# EAGLE schematic CryptoFlashRTC (EAGLE 7.7.0)

## Sheet 1 of 3
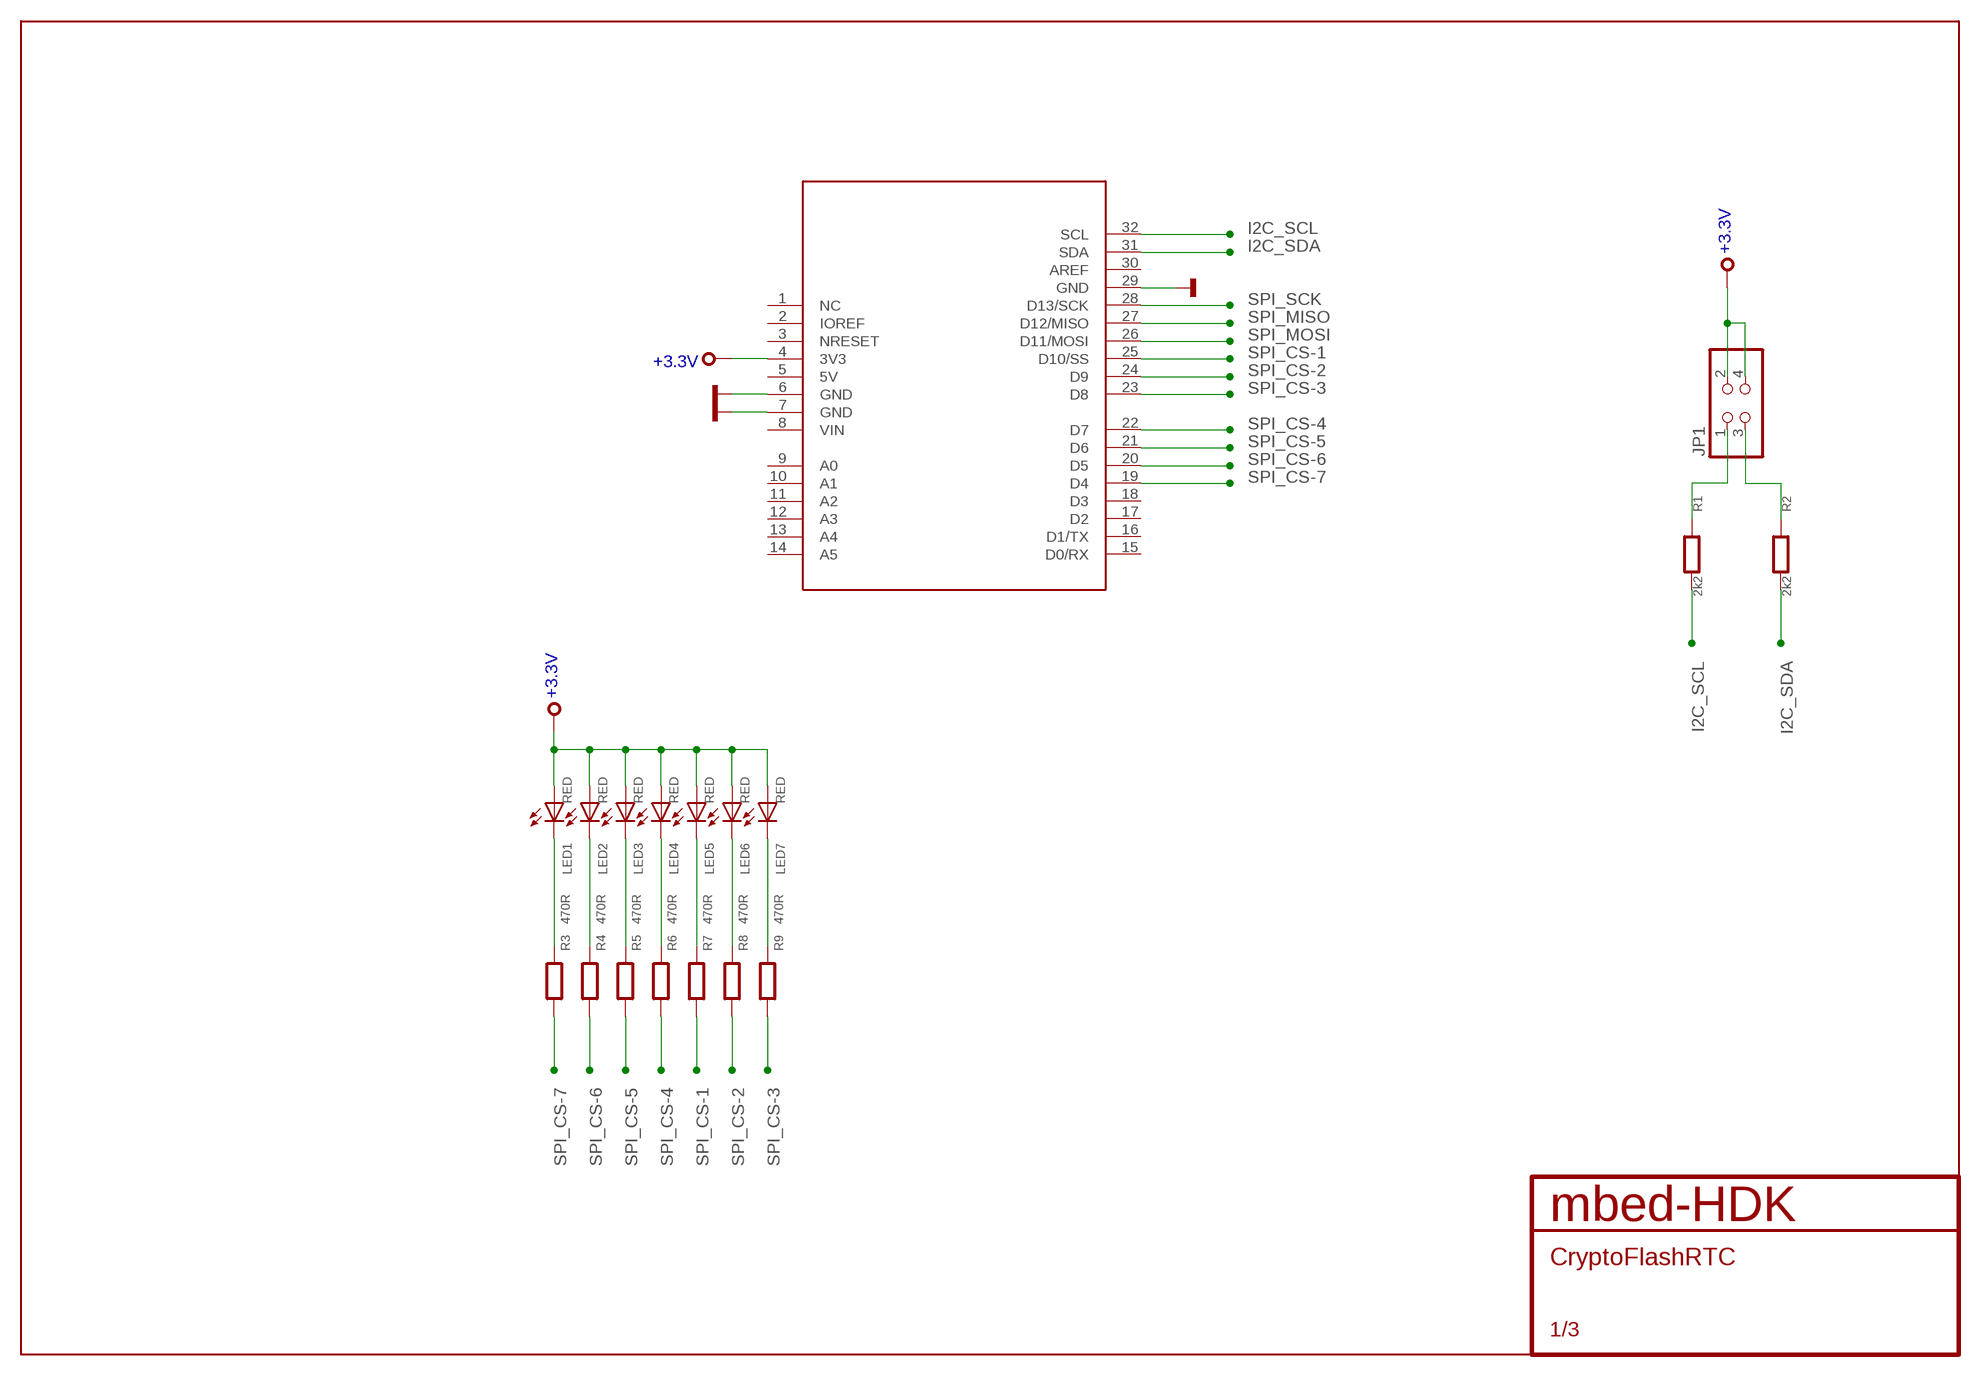
[diagram p0: schematic, sheet 1]

### Parts
BRD1  K64F/K22F-SHIELD  [K64F/K22F]
JP1  PINHD-2X2  [2X02]
LED1  RED  SMD_LED0603  [CHIPLED_0603]
LED2  RED  SMD_LED0603  [CHIPLED_0603]
LED3  RED  SMD_LED0603  [CHIPLED_0603]
LED4  RED  SMD_LED0603  [CHIPLED_0603]
LED5  RED  SMD_LED0603  [CHIPLED_0603]
LED6  RED  SMD_LED0603  [CHIPLED_0603]
LED7  RED  SMD_LED0603  [CHIPLED_0603]
R1  2k2  R0603  [0603]
R2  2k2  R0603  [0603]
R3  470R  R0603  [0603]
R4  470R  R0603  [0603]
R5  470R  R0603  [0603]
R6  470R  R0603  [0603]
R7  470R  R0603  [0603]
R8  470R  RESISTOR0603  [0603]
R9  470R  R0603  [0603]

### Nets
+3.3V: BRD1.4(3V3) JP1.2 JP1.4 LED1.A LED2.A LED3.A LED4.A LED5.A LED6.A LED7.A ; also sheet 2,3
GND: BRD1.6(GND) BRD1.7(GND) BRD1.29(GND) ; also sheet 2,3
I2C_SCL: BRD1.32(SCL) R1.2 ; also sheet 2,3
I2C_SDA: BRD1.31(SDA) R2.2 ; also sheet 2,3
N$1: LED1.C R3.1
N$2: LED2.C R4.1
N$3: LED3.C R5.1
N$4: LED4.C R6.1
N$5: LED5.C R7.1
N$6: LED6.C R8.1
N$7: LED7.C R9.1
N$8: JP1.1 R1.1
N$9: JP1.3 R2.1
SPI_CS-1: BRD1.25(D10/SS) R7.2 ; also sheet 2
SPI_CS-2: BRD1.24(D9) R8.2 ; also sheet 2
SPI_CS-3: BRD1.23(D8) R9.2 ; also sheet 2
SPI_CS-4: BRD1.22(D7) R6.2 ; also sheet 2
SPI_CS-5: BRD1.21(D6) R5.2 ; also sheet 2
SPI_CS-6: BRD1.20(D5) R4.2 ; also sheet 2
SPI_CS-7: BRD1.19(D4) R3.2 ; also sheet 2
SPI_MISO: BRD1.27(D12/MISO) ; also sheet 2
SPI_MOSI: BRD1.26(D11/MOSI) ; also sheet 2
SPI_SCK: BRD1.28(D13/SCK) ; also sheet 2
Unconnected: BRD1.1(NC) BRD1.2(IOREF) BRD1.3(NRESET) BRD1.5(5V) BRD1.8(VIN) BRD1.9(A0) BRD1.10(A1) BRD1.11(A2) BRD1.12(A3) BRD1.13(A4) BRD1.14(A5) BRD1.15(D0/RX) BRD1.16(D1/TX) BRD1.17(D2) BRD1.18(D3) BRD1.30(AREF)

## Sheet 2 of 3
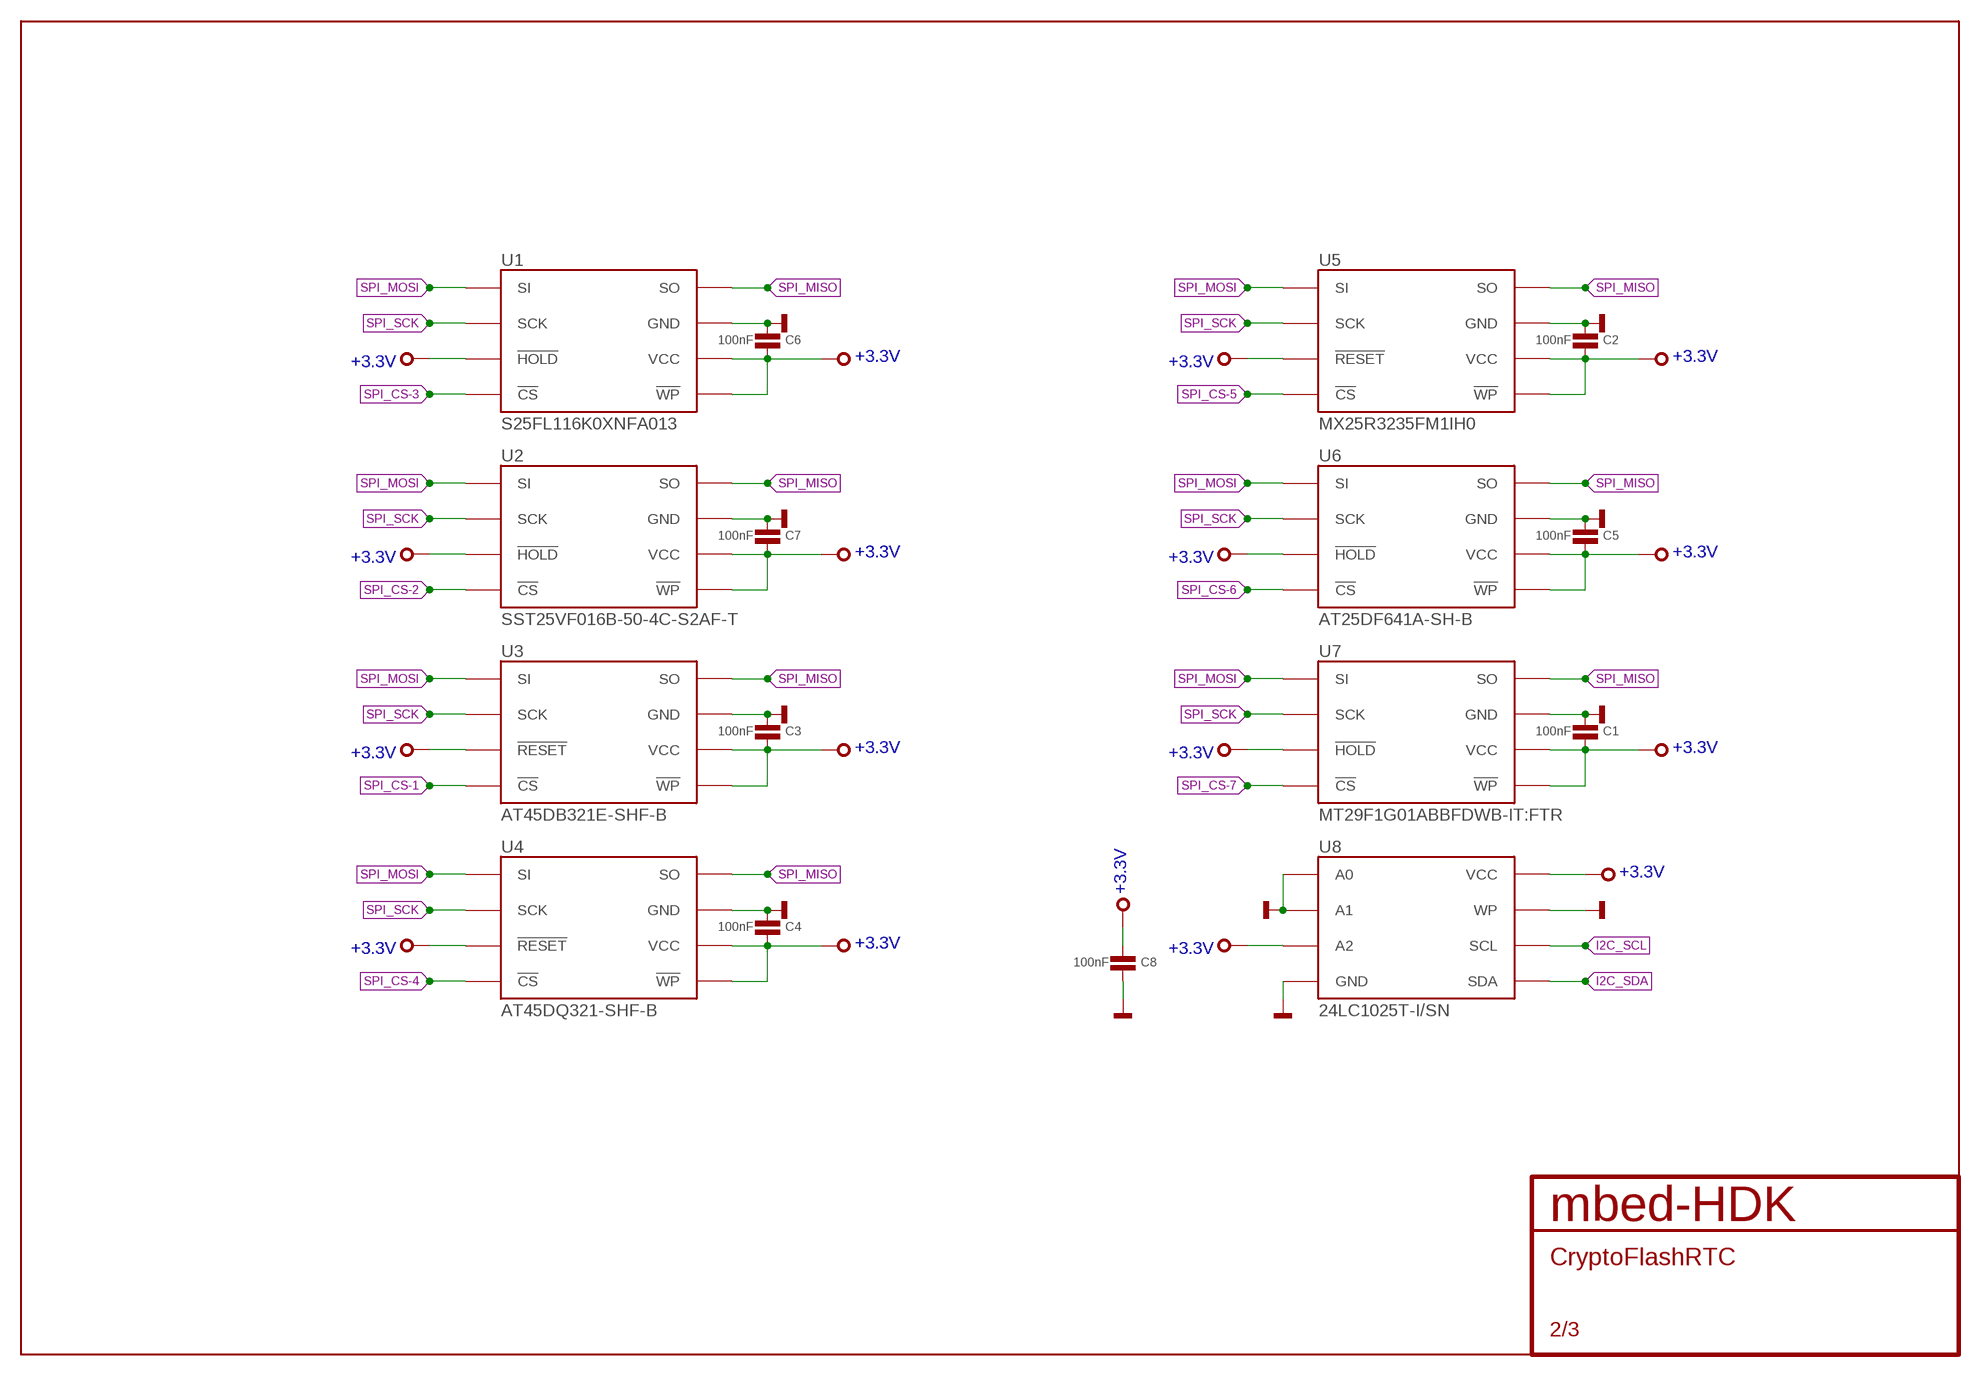
[diagram p1: schematic, sheet 2]

### Parts
C1  100nF  C0603  [0603]
C2  100nF  C0603  [0603]
C3  100nF  C0603  [0603]
C4  100nF  C0603  [0603]
C5  100nF  C0603  [0603]
C6  100nF  C0603  [0603]
C7  100nF  C0603  [0603]
C8  100nF  C0603  [0603]
U1  S25FL116K0XNFA013  [SO8-WIDE@1]
U2  SST25VF016B-50-4C-S2AF-T  [SO8-WIDE]
U3  AT45DB321E-SHF-B  [SO8-WIDE]
U4  AT45DQ321-SHF-B  [SO8-WIDE]
U5  MX25R3235FM1IH0  [SO8]
U6  AT25DF641A-SH-B  [SO8-WIDE]
U7  MT29F1G01ABBFDWB-IT:FTR  [8-U-PDFN]
U8  24LC1025T-I/SN  [SO8]

### Nets
+3.3V: C1.1 C2.1 C3.1 C4.1 C5.1 C6.1 C7.1 C8.2 U1.3(!WP) U1.7(!HOLD) U1.8(VCC) U2.3(!WP) U2.7(!HOLD) U2.8(VCC) U3.3(!RESET) U3.5(!WP) U3.6(VCC) U4.3(!RESET) U4.5(!WP) U4.6(VCC) U5.3(!WP) U5.7(!RESET) U5.8(VCC) U6.3(!WP) U6.7(!HOLD) U6.8(VCC) U7.3(!WP) U7.7(!HOLD) U7.8(VCC) U8.3(A2) U8.8(VCC) ; also sheet 1,3
GND: C1.2 C2.2 C3.2 C4.2 C5.2 C6.2 C7.2 C8.1 U1.4(GND) U2.4(GND) U3.7(GND) U4.7(GND) U5.4(GND) U6.4(GND) U7.4(GND) U8.1(A0) U8.2(A1) U8.4(GND) U8.7(WP) ; also sheet 1,3
I2C_SCL: U8.6(SCL) ; also sheet 1,3
I2C_SDA: U8.5(SDA) ; also sheet 1,3
SPI_CS-1: U3.4(!CS) ; also sheet 1
SPI_CS-2: U2.1(!CS) ; also sheet 1
SPI_CS-3: U1.1(!CS) ; also sheet 1
SPI_CS-4: U4.4(!CS) ; also sheet 1
SPI_CS-5: U5.1(!CS) ; also sheet 1
SPI_CS-6: U6.1(!CS) ; also sheet 1
SPI_CS-7: U7.1(!CS) ; also sheet 1
SPI_MISO: U1.2(SO) U2.2(SO) U3.8(SO) U4.8(SO) U5.2(SO) U6.2(SO) U7.2(SO) ; also sheet 1
SPI_MOSI: U1.5(SI) U2.5(SI) U3.1(SI) U4.1(SI) U5.5(SI) U6.5(SI) U7.5(SI) ; also sheet 1
SPI_SCK: U1.6(SCK) U2.6(SCK) U3.2(SCK) U4.2(SCK) U5.6(SCK) U6.6(SCK) U7.6(SCK) ; also sheet 1

## Sheet 3 of 3
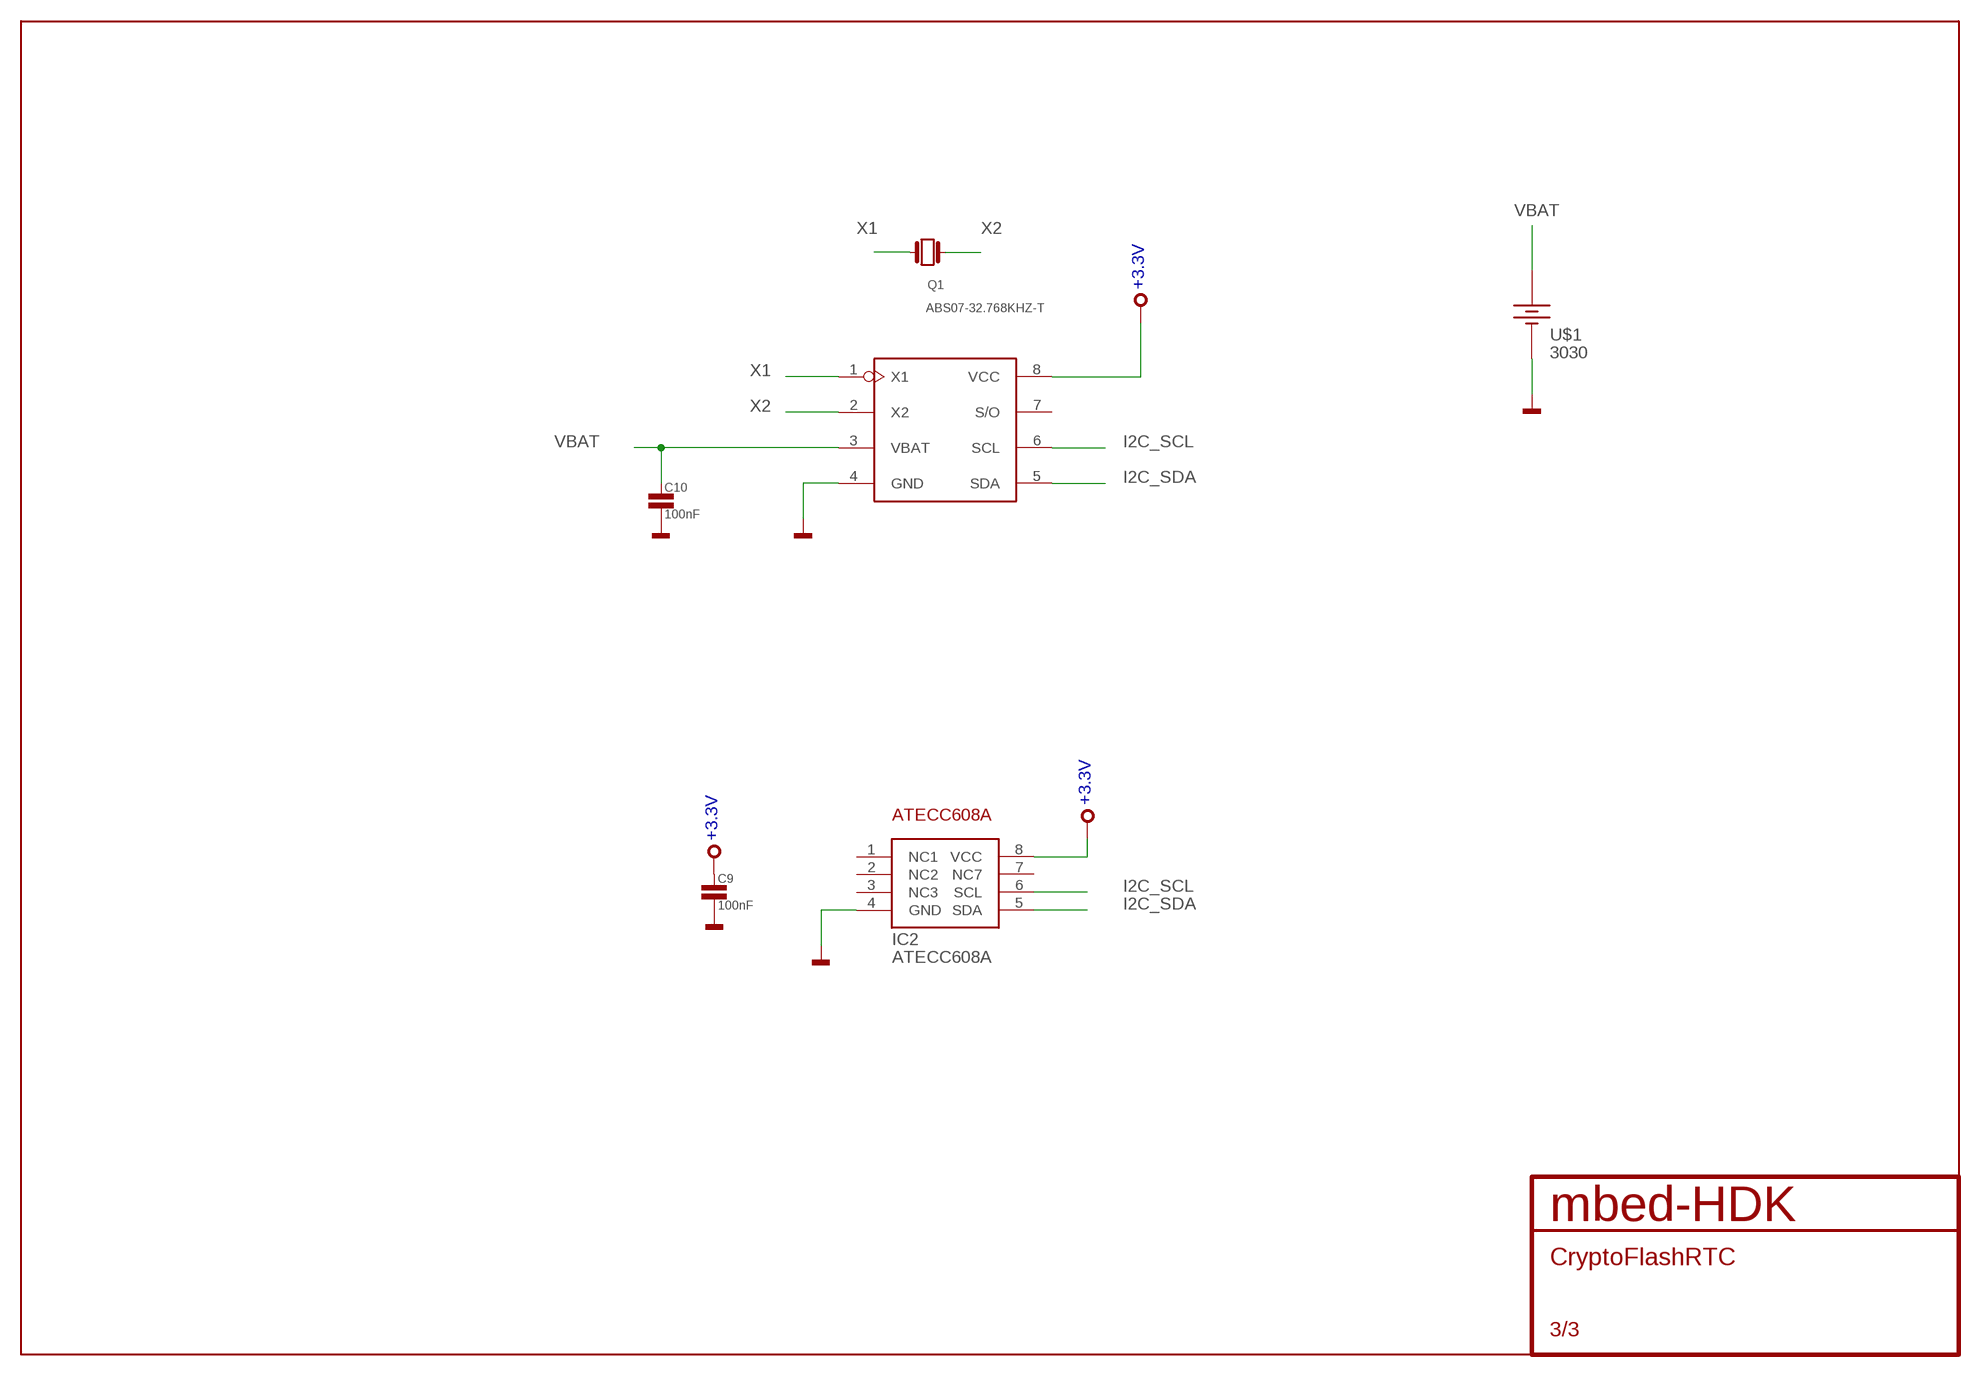
[diagram p2: schematic, sheet 3]

### Parts
C9  100nF  C0603  [0603]
C10  100nF  C0603  [0603]
IC2  ATECC608A  [SO8]
Q1  ABS07-32.768KHZ-T  [FC135]
U9  DS1307  [SO08]
U$1  3030  [3030]

### Nets
+3.3V: C9.1 IC2.8(VCC) U9.8(VCC) ; also sheet 1,2
GND: C9.2 C10.2 IC2.4(GND) U9.4(GND) U$1.NEG(-) ; also sheet 1,2
I2C_SCL: IC2.6(SCL) U9.6(SCL) ; also sheet 1,2
I2C_SDA: IC2.5(SDA) U9.5(SDA) ; also sheet 1,2
VBAT: C10.1 U9.3(VBAT) U$1.P$1(+) U$1.P$2(+)
X1: Q1.X1 U9.1(X1)
X2: Q1.X2 U9.2(X2)
Unconnected: IC2.1(NC1) IC2.2(NC2) IC2.3(NC3) IC2.7(NC7) U9.7(S/O)

## Library data of the parts
BRD1 = mbed-HDK-misc-Board:K64F/K22F-SHIELD: Shield for K64F/K22F
C1-C10 = mbed-HDK-RLC:C: Capacitor
IC2 = mbed-HDK-MF-ATMEL:ATECC608A
JP1 = pinhead:PINHD-2X2: PIN HEADER
LED1-LED7 = mbed-HDK-Optical:SMD_LED: LED SMD, Colour Red; MF: Wurth Electronics Inc; MFN: 150060RS75000; OC-DIGIKEY: 732-4978-1-ND; OC-MOUSER: 710-150060RS75000; OC-NEWARK: 2322071
Q1 = mbed-HDK-Oscillator:ABS07-32.768KHZ-T: Crystal, Abracon 32.768kHz ±20ppm 12.5pF; MF: Abracon; MFN: ABS07-32.768KHZ-T; OC-DIGIKEY: 535-9542-1-ND; OC-MOUSER: 535-9542-1-ND; OC-NEWARK: 2101347
R1-R7 R9 = mbed-HDK-RLC:R: Resistor
R8 = mbed-HDK-RLC:RESISTOR: Resistor
U1 = mbed-HDK-IC:S25FL116K0XNFA013: Serial Flash 16Mb 108 Mhz; MF: Cypress Semiconductor Corp; MFN: S25FL116K0XNFA013; OC-DIGIKEY: 428-4343-1-ND; OC-MOUSER: 727-25FL116K0XNFA013
U2 = mbed-HDK-IC:SST25VF016B-50-4C-S2AF-T: Serial Flash 16Mb 50 Mhz; MF: Microchip; MFN: SST25VF016B-50-4C-S2AF-T; OC-DIGIKEY: SST25VF016B-50-4C-S2AF-TCT-ND; OC-MOUSER: 579-25VF016B5CS2AF-T
U3 = mbed-HDK-IC:AT45DB321E-SHF-B: Serial Flash 32 Mb 85 Mhz; MF: Adesto Technologies; MFN: AT45DB321E-SHF-B; OC-DIGIKEY: 1265-1072-5-ND; OC-MOUSER: 988-AT45DB321E-SHF-B; OC-NEWARK: 2414318
U4 = mbed-HDK-IC:AT45DQ321-SHF-B: Serial Flash 32 Mb 104 Mhz; MF: Adesto Technologies; MFN: AT45DQ321-SHF-B; OC-DIGIKEY: AT45DQ321-SHF-B-ND; OC-MOUSER: 988-AT45DQ321-SHF-B
U5 = mbed-HDK-IC:MX25R3235FM1IH0: Serial Flash 32 Mb 80 Mhz; MF: Macronix; MFN: MX25R3235FM1IH0; OC-DIGIKEY: 1092-1175-ND
U6 = mbed-HDK-IC:AT25DF641A-SH-B: Serial Flash 64 Mb 100 Mhz; MF: Adesto Technologies; MFN: AT25DF641A-SH-B; OC-DIGIKEY: 1265-1047-ND; OC-MOUSER: 988-AT25DF641A-SH-B
U7 = mbed-HDK-IC:MT29F1G01ABBFDWB-IT:FTR: SPI FLASH NAND 1GB; MF: Micron Technology Inc.; MFN: MT29F1G01ABBFDWB-IT:F TR; OC-DIGIKEY: 557-1655-1-ND
U8 = mbed-HDK-IC:24LC1025T-I/SN: EEPROM IC 1MBIT 400KHZ 8SOIC; MF: Microchip Technology; MFN: 24LC1025T-I/SN; OC-DIGIKEY: 24LC1025T-I/SNCT-ND; OC-MOUSER: 579-24LC1025T-I/SN; OC-NEWARK: 86W6594
U9 = Seeed:DS1307
U$1 = mbed-HDK-Connector:3030: CR927, CR1025 Battery Holder for 9-10mm Cells-Tin Nickel Plated SMD; MF: Keystone; MFN: 3030; OC-DIGIKEY: 36-3030-ND; OC-MOUSER: 534-3030; OC-NEWARK: 39T8899